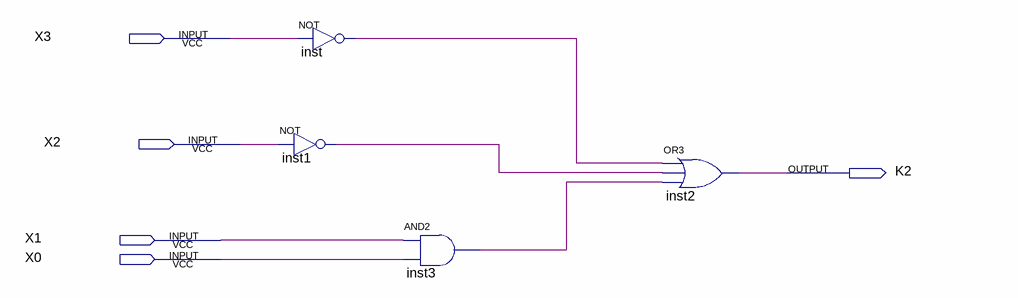
[diagram p0: schematic sheet]
// Quartus schematic K2.bdf as structural Verilog: 4 symbols, 5 pins
module K2 (
  input  X3,
  input  X2,
  input  X1,
  input  X0,
  output K2
);

  wire inst1_out, inst3_out, inst_out;

  not inst (inst_out, X3);
  not inst1 (inst1_out, X2);
  and inst3 (inst3_out, X1, X0);
  or inst2 (K2, inst_out, inst1_out, inst3_out);
endmodule
